# EAGLE design AktuatorPlatine (EAGLE 9.6.2)
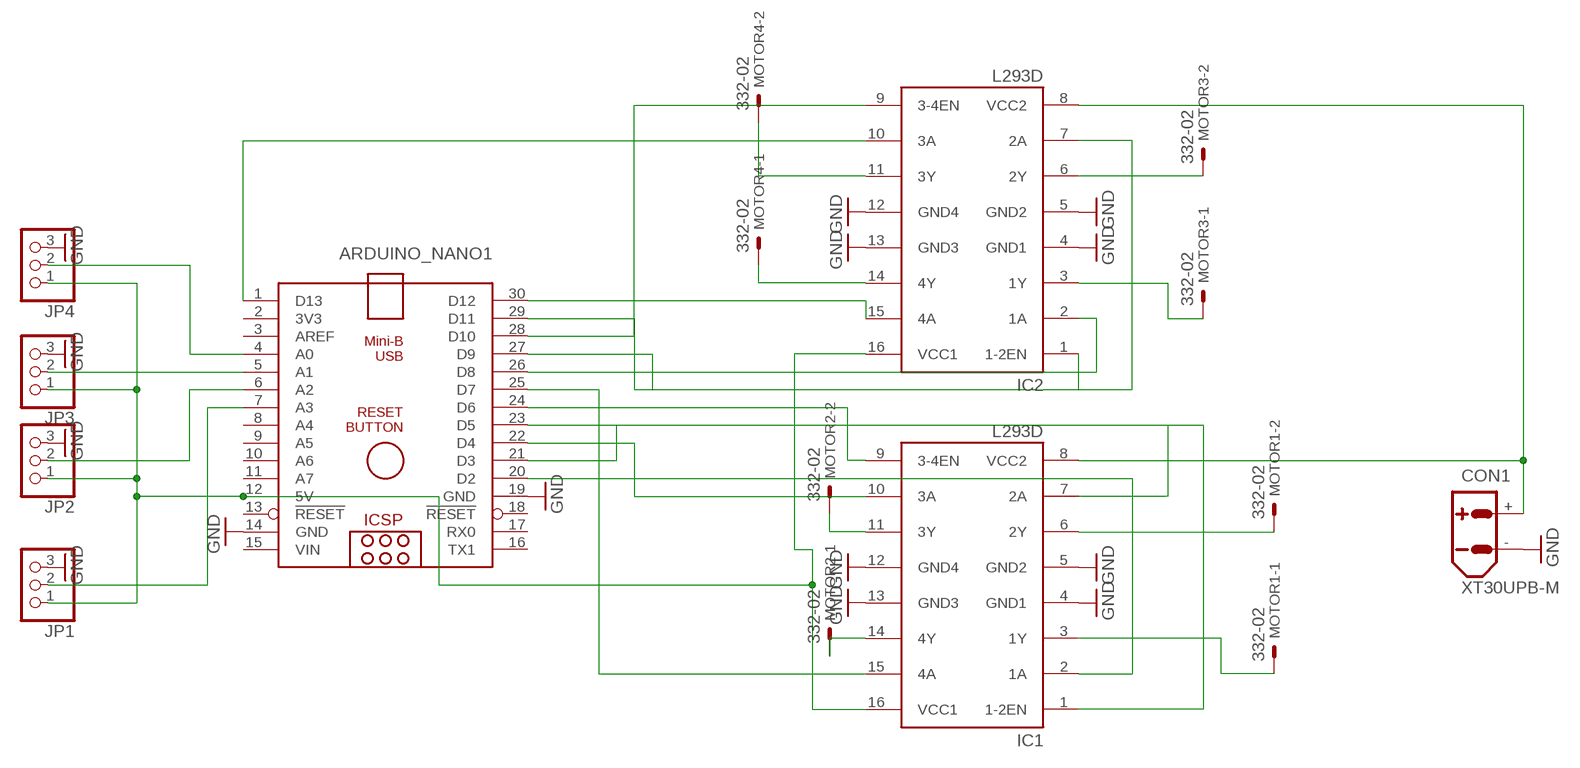
[diagram p0: schematic, sheet 1]

## Parts
ARDUINO_NANO1  ARDUINO_NANO  [ARDUINO_NANO]
CON1  XT30UPB-M  [XT30UPB-M]
IC1  L293D  [DIL16]
IC2  L293D  [DIL16]
JP1  PINHD-1X3  [1X03]
JP2  PINHD-1X3  [1X03]
JP3  PINHD-1X3  [1X03]
JP4  PINHD-1X3  [1X03]
MOTOR1  332-02  [332-02]
MOTOR2  332-02  [332-02]
MOTOR3  332-02  [332-02]
MOTOR4  332-02  [332-02]

## Nets
GND: ARDUINO_NANO1.14(GND) ARDUINO_NANO1.19(GND) CON1.- IC1.4(GND1) IC1.5(GND2) IC1.12(GND4) IC1.13(GND3) IC2.4(GND1) IC2.5(GND2) IC2.12(GND4) IC2.13(GND3) JP1.3 JP2.3 JP3.3 JP4.3
N$1: ARDUINO_NANO1.20(D2) IC1.2(1A)
N$2: ARDUINO_NANO1.21(D3) IC1.7(2A)
N$3: ARDUINO_NANO1.22(D4) IC1.10(3A)
N$4: ARDUINO_NANO1.23(D5) IC1.1(1-2EN)
N$5: ARDUINO_NANO1.24(D6) IC1.9(3-4EN)
N$6: ARDUINO_NANO1.27(D9) IC2.1(1-2EN)
N$7: ARDUINO_NANO1.25(D7) IC1.15(4A)
N$8: ARDUINO_NANO1.28(D10) IC2.9(3-4EN)
N$9: ARDUINO_NANO1.26(D8) IC2.2(1A)
N$10: ARDUINO_NANO1.29(D11) IC2.7(2A)
N$11: ARDUINO_NANO1.30(D12) IC2.15(4A)
N$12: ARDUINO_NANO1.1(D13) IC2.10(3A)
N$13: ARDUINO_NANO1.12(5V) IC1.16(VCC1) IC2.16(VCC1) JP1.1 JP2.1 JP3.1 JP4.1
N$14: CON1.+ IC1.8(VCC2) IC2.8(VCC2)
N$15: ARDUINO_NANO1.4(A0) JP4.2
N$16: IC1.3(1Y) MOTOR1.1
N$17: IC1.6(2Y) MOTOR1.2
N$18: IC2.3(1Y) MOTOR3.1
N$19: IC2.6(2Y) MOTOR3.2
N$20: IC2.11(3Y) MOTOR4.2
N$21: IC2.14(4Y) MOTOR4.1
N$22: IC1.11(3Y) MOTOR2.2
N$23: IC1.14(4Y) MOTOR2.1
N$24: ARDUINO_NANO1.5(A1) JP3.2
N$25: ARDUINO_NANO1.6(A2) JP2.2
N$26: ARDUINO_NANO1.7(A3) JP1.2
Unconnected: ARDUINO_NANO1.2(3V3) ARDUINO_NANO1.3(AREF) ARDUINO_NANO1.8(A4) ARDUINO_NANO1.9(A5) ARDUINO_NANO1.10(A6) ARDUINO_NANO1.11(A7) ARDUINO_NANO1.13(!RESET) ARDUINO_NANO1.16(TX1) ARDUINO_NANO1.17(RX0) ARDUINO_NANO1.18(!RESET)

## Power pins joined to a net without a drawn wire
VIN: ARDUINO_NANO1.15(VIN)

## Library data of the parts
ARDUINO_NANO1 = ArduinoNanoV30:ARDUINO_NANO: Arduino Nano V3.0 Overview: The Arduino Nano is a small, complete, and breadboard-friendly board based on the ATmega328 (Arduino Nano 3.x) or ATmega168 (Arduino Nano 2.x). It has more or less the same functionality of the Arduino Duemilanove, but in a different package. It lacks only a DC power jack, and works with a Mini-B USB cable instead of a standard one. The Nano was designed and is being produced by Gravitech. Specifications: Microcontroller Atmel ATmega168 or ATmega328 Operating Voltage (logic level) 5 V Input Voltage (recommended) 7-12 V Input Voltage (limits) 6-20 V Digital I/O Pins 14 (of which 6 provide PWM output) Analog Input Pins 8 DC Current per I/O Pin 40 mA Flash Memory 16 KB (ATmega168) or 32 KB (ATmega328) of which 2 KB used by bootloader SRAM 1 KB (ATmega168) or 2 KB (ATmega328) EEPROM 512 bytes (ATmega168) or 1 KB (ATmega328) Clock Speed 16 MHz Dimensions 0.73" x 1.70" Length 45 mm Width 18 mm Weigth 5 g Power: The Arduino Nano can be powered via the Mini-B USB connection, 6-20V unregulated external power supply (pin 30), or 5V regulated external power supply (pin 27). The power source is automatically selected to the highest voltage source. Memory: The ATmega168 has 16 KB of flash memory for storing code (of which 2 KB is used for the bootloader); the ATmega328 has 32 KB, (also with 2 KB used for the bootloader). The ATmega168 has 1 KB of SRAM and 512 bytes of EEPROM (which can be read and written with the EEPROM library); the ATmega328 has 2 KB of SRAM and 1 KB of EEPROM. Input and Output: Each of the 14 digital pins on the Nano can be used as an input or output, using pinMode(), digitalWrite(), and digitalRead() functions. They operate at 5 volts. Each pin can provide or receive a maximum of 40 mA and has an internal pull-up resistor (disconnected by default) of 20-50 kOhms. In addition, some pins have specialized functions. Visit Arduino - ArduinoBoardNano <https://www.arduino.cc/en/Main/ArduinoBoardNano>
CON1 = amass:XT30: AMASS XT30 connector Store in Japan AMASS XT30 connector <https://szc.jp/ams-xt30>
IC1 IC2 = st-microelectronics:L293D: PUSH-PULL 4 CHANNEL DRIVER; MPN: L293D; OC_FARNELL: 9589619; OC_NEWARK: 56P8249
JP1-JP4 = pinhead:PINHD-1X3: PIN HEADER
MOTOR1-MOTOR4 = con-garry:332-02: 2 Pin - 2mm Dual Row Source: www.mpe-connector.de / garry_shortform_2012.pdf

## Net classes
0 default: width 0.508 mm, clearance 0.254 mm

## Board
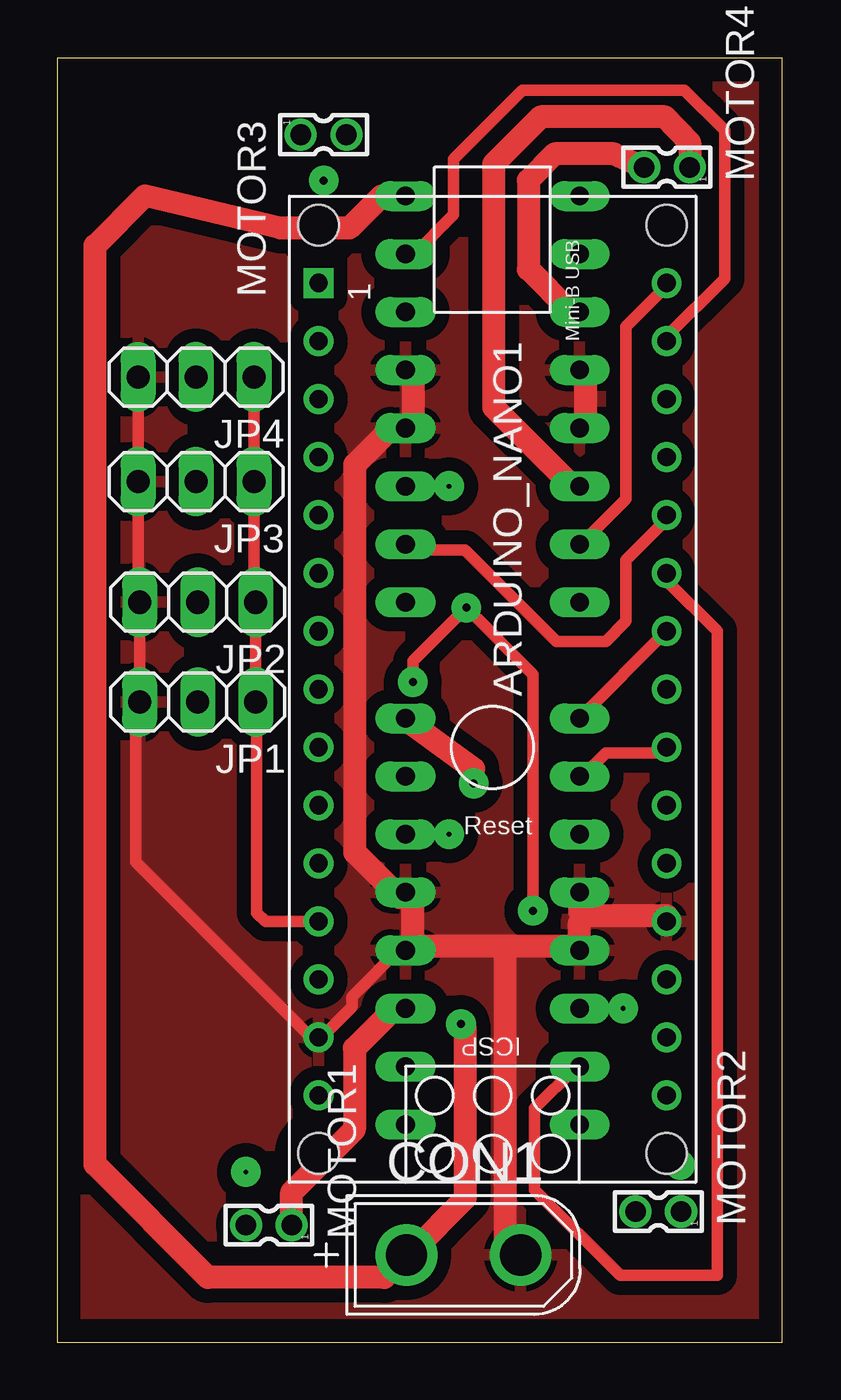
[diagram p1: board, top side]
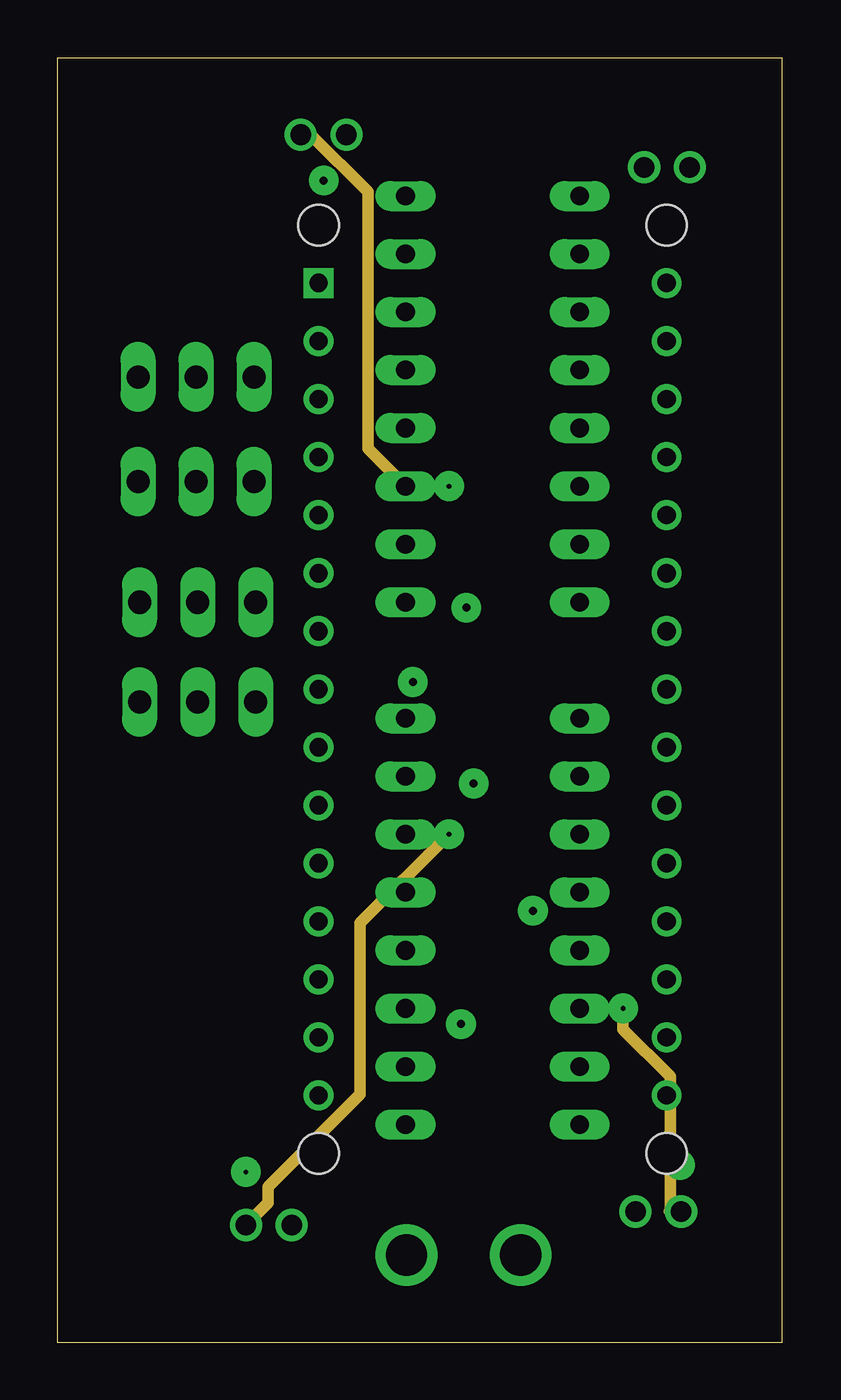
[diagram p2: board, inner layer Route2]
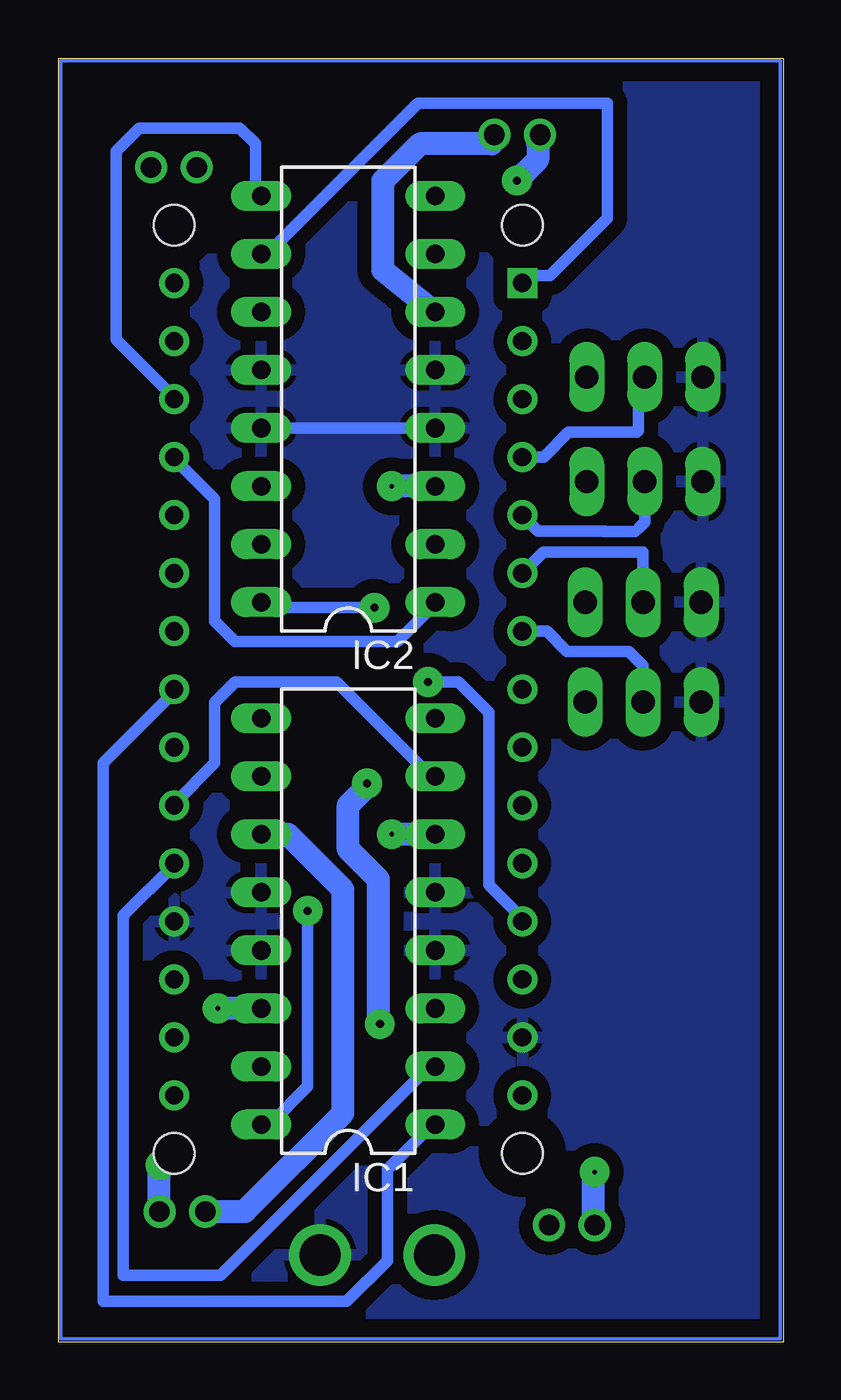
[diagram p3: board, bottom side, seen from below]

Size 31.73 x 56.19 mm. Coordinates in mm from the lower left corner, seen from the top.
Outline: 0,0 31.73,0 31.73,56.19 0,56.19 0,0
Copper layers (1+2*15+16): Top 0.035mm / dielectric 1.5mm / Route2 0.035mm / dielectric 0.15mm / Route15 0.035mm / dielectric 0.2mm / Bottom 0.035mm
Design rules "default *": minimum track width 6mil, minimum drill 0.35mm, track to track 15mil, track to pad 15mil, pad to pad 6mil, via to via 6mil, smd to smd 6mil, copper to edge 40mil, drill to drill 6mil, minimum pad ring 10mil, minimum via ring 8mil, stop-mask expansion 4mil, vias tented up to drill 0mil, thermal gap 10mil

### Footprints (pad centres in the part's own frame; a part is rotated, then mirrored left to right if it is on the bottom)
ARDUINO_NANO = drill 0.8 square: 1 -20.32,-7.62 | drill 0.8: 2 -17.78,-7.62; 3 -15.24,-7.62; 4 -12.7,-7.62; 5 -10.16,-7.62; 6 -7.62,-7.62; 7 -5.08,-7.62; 8 -2.54,-7.62; 9 0,-7.62; 10 2.54,-7.62; 11 5.08,-7.62; 12 7.62,-7.62; 13 10.16,-7.62; 14 12.7,-7.62; 15 15.24,-7.62; 16 15.24,7.62; 17 12.7,7.62; 18 10.16,7.62; 19 7.62,7.62; 20 5.08,7.62; 21 2.54,7.62; 22 0,7.62; 23 -2.54,7.62; 24 -5.08,7.62; 25 -7.62,7.62; 26 -10.16,7.62; 27 -12.7,7.62; 28 -15.24,7.62; 29 -17.78,7.62; 30 -20.32,7.62 | hole 1.778: -22.86,-7.62; -22.86,7.62; 17.78,7.62; 17.78,-7.62
XT30UPB-M = drill 1.8: + 2.5,0; - -2.5,0
DIL16 = drill 0.813 long: 1 -8.89,-3.81; 2 -6.35,-3.81; 3 -3.81,-3.81; 4 -1.27,-3.81; 5 1.27,-3.81; 6 3.81,-3.81; 7 6.35,-3.81; 8 8.89,-3.81; 9 8.89,3.81; 10 6.35,3.81; 11 3.81,3.81; 12 1.27,3.81; 13 -1.27,3.81; 14 -3.81,3.81; 15 -6.35,3.81; 16 -8.89,3.81
1X03 = drill 1.016 long: 1 -2.54,0; 2 0,0; 3 2.54,0
332-02 = drill 0.9 pad 1.27: 1 0,-1; 2 0,1

### Placement (x,y rotation side)
ARDUINO_NANO1  19.05,26.04 270 top
CON1  17.78,3.81 180 top
IC1  19.05,18.41 90 bottom
IC2  19.05,41.27 90 bottom
JP1  6.14,28.02 180 top
JP2  6.14,32.38 180 top
JP3  6.07,37.66 180 top
JP4  6.07,42.24 180 top
MOTOR1  9.26,5.12 90 top
MOTOR2  26.31,5.71 90 top
MOTOR3  11.65,52.84 270 top
MOTOR4  26.68,51.42 90 top

### Tracks (layer width: path | path; a pad name or v marks a point on that pad's centre or on a via)
GND
  Top 0.508: 15.56,40.01 IC2.4 14.62,40.01 | 15.56,42.23 IC2.5 | 23.11,40.01 IC2.13 | 23.11,42.23 IC2.12 | 23.15,18.67 23.03,18.67 22.86,18.84 | 26.67,18.67 ARDUINO_NANO1.19 | 22.67,17.34 IC1.13 | 15.56,17.34 IC1.4 15.11,17.34 12.89,15.11 12.89,14.67 11.56,13.34 ARDUINO_NANO1.14 11.11,13.34 3.42,21.02 3.42,26.96 3.6,27.14 JP2.3 3.53,32.45 JP3.3 JP4.3 | 19.58,4.29 CON1.- | 15.01,19.45 IC1.5
  Top 1.016: 15.56,42.23 15.56,40.01 | 23.11,42.23 23.11,40.01 | 26.67,18.67 23.15,18.67 22.86,18.38 IC1.13 | IC1.12 22.86,18.84 | IC1.5 15.56,19.56 15.56,17.34 19.58,17.34 | 19.58,17.34 22.67,17.34 | 19.58,17.34 19.58,4.29 | 14.62,40.01 13.03,38.41 13.03,21.43 15.01,19.45
  Bottom 0.508: IC2.13 IC2.4
  pour Top (isolate 0.61): 0.28,0.35 31.36,0.35 31.43,0.28 31.43,55.88 0.28,55.88
  pour Bottom (isolate 0.61): 0.28,0.28 31.43,0.28 31.43,55.88 0.28,55.88
N$1
  Bottom 0.508: ARDUINO_NANO1.20 26.67,20.89 28.89,18.67 28.89,2.92 24.64,2.92 15.56,12 IC1.2
N$2
  Bottom 0.508: ARDUINO_NANO1.21 26.67,23.56 24.89,25.34 24.89,28 24,28.89 19.56,28.89 15.56,24.89 IC1.7
N$3
  Top 0.508: ARDUINO_NANO1.22 26.67,25.78 24,25.78 23.11,24.89 IC1.10
N$4
  Bottom 0.508: ARDUINO_NANO1.23 26.67,28.45 29.78,25.34 29.78,1.78 19.11,1.78 17.34,3.56 17.34,7.56 15.56,9.34 IC1.1
N$5
  Top 0.508: IC1.9 ARDUINO_NANO1.24
N$6
  Bottom 0.508: ARDUINO_NANO1.27 26.67,38.67 24.89,36.89 24.89,31.56 24,30.67 16.89,30.67 15.56,32 IC2.1
N$7
  Top 0.508: ARDUINO_NANO1.25 26.67,33.34 28.89,31.11 28.89,2.92 24.64,2.92 20.89,6.67 20.89,10.22 22.67,12 IC1.15
N$8
  Bottom 0.508: ARDUINO_NANO1.28 26.67,41.34 29.22,43.88 29.22,52.13 28.21,53.14 23.8,53.14 23.11,52.45 23.11,50.23 IC2.9
N$9
  Top 0.508: ARDUINO_NANO1.26 26.67,36.01 24.89,34.23 24.89,31.56 24,30.67 21.85,30.67 17.85,34.67 15.56,34.67 IC2.2
N$10
  Top 0.508: ARDUINO_NANO1.29 26.67,44.01 29.22,46.55 29.22,53.03 27.46,54.79 20.36,54.79 17.34,51.77 17.34,49.34 15.56,47.56 IC2.7
N$11
  Top 0.508: ARDUINO_NANO1.30 26.67,46.23 24.89,44.45 24.89,36.89 23.11,35.12 IC2.15
N$12
  Bottom 0.508: ARDUINO_NANO1.1 11.11,46.67 10.22,46.67 7.7,49.19 7.7,54.23 16,54.23 22.67,47.56 IC2.10
N$13  (via drill 0.35 pad 1.3)
  Top 0.508: v20.82,18.88 20.82,29.22 v17.9,32.14 15.56,29.8 v15.56,28.89 | JP4.1 JP3.1 8.61,32.45 JP2.1 JP1.1 8.73,27.96 8.73,18.79 9.11,18.41 ARDUINO_NANO1.12
  Bottom 0.508: IC1.16 22.48,9.53 20.82,11.18 v20.82,18.88 | v17.9,32.14 22.74,32.14 IC2.16 | v15.56,28.89 14.22,28.89 12.89,27.56 12.89,20 11.56,18.67 ARDUINO_NANO1.12
N$14  (via drill 0.35 pad 1.3)
  Top 0.508: 15.31,27.22 IC1.8 | 15.56,4 CON1.+
  Top 1.016: v18.22,24.45 18.22,25.09 15.31,27.22 | v17.67,13.92 17.85,13.73 17.85,6.29 15.56,4 | IC2.8 14.19,50.16 12.78,48.76 9.77,48.76 3.82,50.17 1.65,47.99 1.65,7.77 6.58,2.83 14.3,2.83 CON1.+
  Bottom 0.508: 18.22,24.32 v18.22,24.45
  Bottom 1.016: v17.67,13.92 17.74,13.99 17.74,20.27 19.05,21.58 19.05,23.5 18.22,24.32
N$15
  Bottom 0.508: JP4.2 6.35,41.96 6.35,39.89 6.42,39.82 9.4,39.82 10.48,38.73 ARDUINO_NANO1.4
N$16
  Top 1.016: IC1.3 14.75,14.61 13.01,12.86 13.01,9.31 10.26,6.56 MOTOR1.1
N$17  (via drill 0.2 pad 1.3)
  Route2 0.508: v17.14,22.23 13.26,18.34 13.26,10.83 9.23,6.8 9.23,6.09 MOTOR1.2
  Bottom 1.016: IC1.6 v17.14,22.23
N$18  (via drill 0.2 pad 1.3)
  Route2 0.508: MOTOR3.1 11.09,52.84 13.59,50.35 13.59,39.12 IC2.3
  Bottom 1.016: IC2.3 v17.14,37.47
N$19
  Bottom 0.508: 12.78,52.45 MOTOR3.2
  Bottom 1.016: 12.78,52.45 15.91,52.45 17.55,50.81 17.55,46.93 IC2.6
N$20
  Top 1.016: IC2.11 22.48,45.09 20.61,46.95 20.61,50.84 21.78,52.01 24.37,52.01 MOTOR4.2
N$21
  Top 1.016: IC2.14 22.54,37.47 19.09,40.91 19.09,51.56 21.16,53.63 26.6,53.63 27.68,52.5 MOTOR4.1
N$22
  Bottom 0.508: 21.69,22.23 IC1.11
  Bottom 1.016: 21.69,22.23 19.28,19.81 19.28,10.01 23.58,5.71 MOTOR2.2
N$23  (via drill 0.2 pad 1.3)
  Route2 0.508: MOTOR2.1 26.78,5.71 26.83,5.76 26.83,11.63 24.77,13.7 v24.77,14.61
  Bottom 1.016: IC1.14 v24.77,14.61
N$24
  Bottom 0.508: JP3.2 6.07,35.89 6.28,35.68 6.36,35.6 6.49,35.47 7.85,35.47 7.82,35.5 10.74,35.5 ARDUINO_NANO1.5
N$25
  Bottom 0.508: JP2.2 6.14,34.58 10.51,34.58 ARDUINO_NANO1.6
N$26
  Bottom 0.508: JP1.2 6.14,29.61 6.76,30.23 9.47,30.23 10.36,31.11 ARDUINO_NANO1.7
N$27  (via drill 0.2 pad 1.3)
  other vias: 8.26,7.45
N$28  (via drill 0.2 pad 1.3)
  other vias: 27.27,7.75
N$29
  Bottom 1.016: 8.32,5.37 8.32,6.99
N$30
  Bottom 1.016: 27.32,5.9 27.32,7.52
N$31  (via drill 0.35 pad 1.3)
  Bottom 1.016: 10.75,52.46 10.75,51.75 v11.66,50.84
N$32
  Bottom 0.152: 0.14,56.09 0.14,0.14 31.64,0.14 31.64,56.09 0.14,56.09